# EAGLE schematic RAFT_DuckLink_Charger (EAGLE 9.5.2)
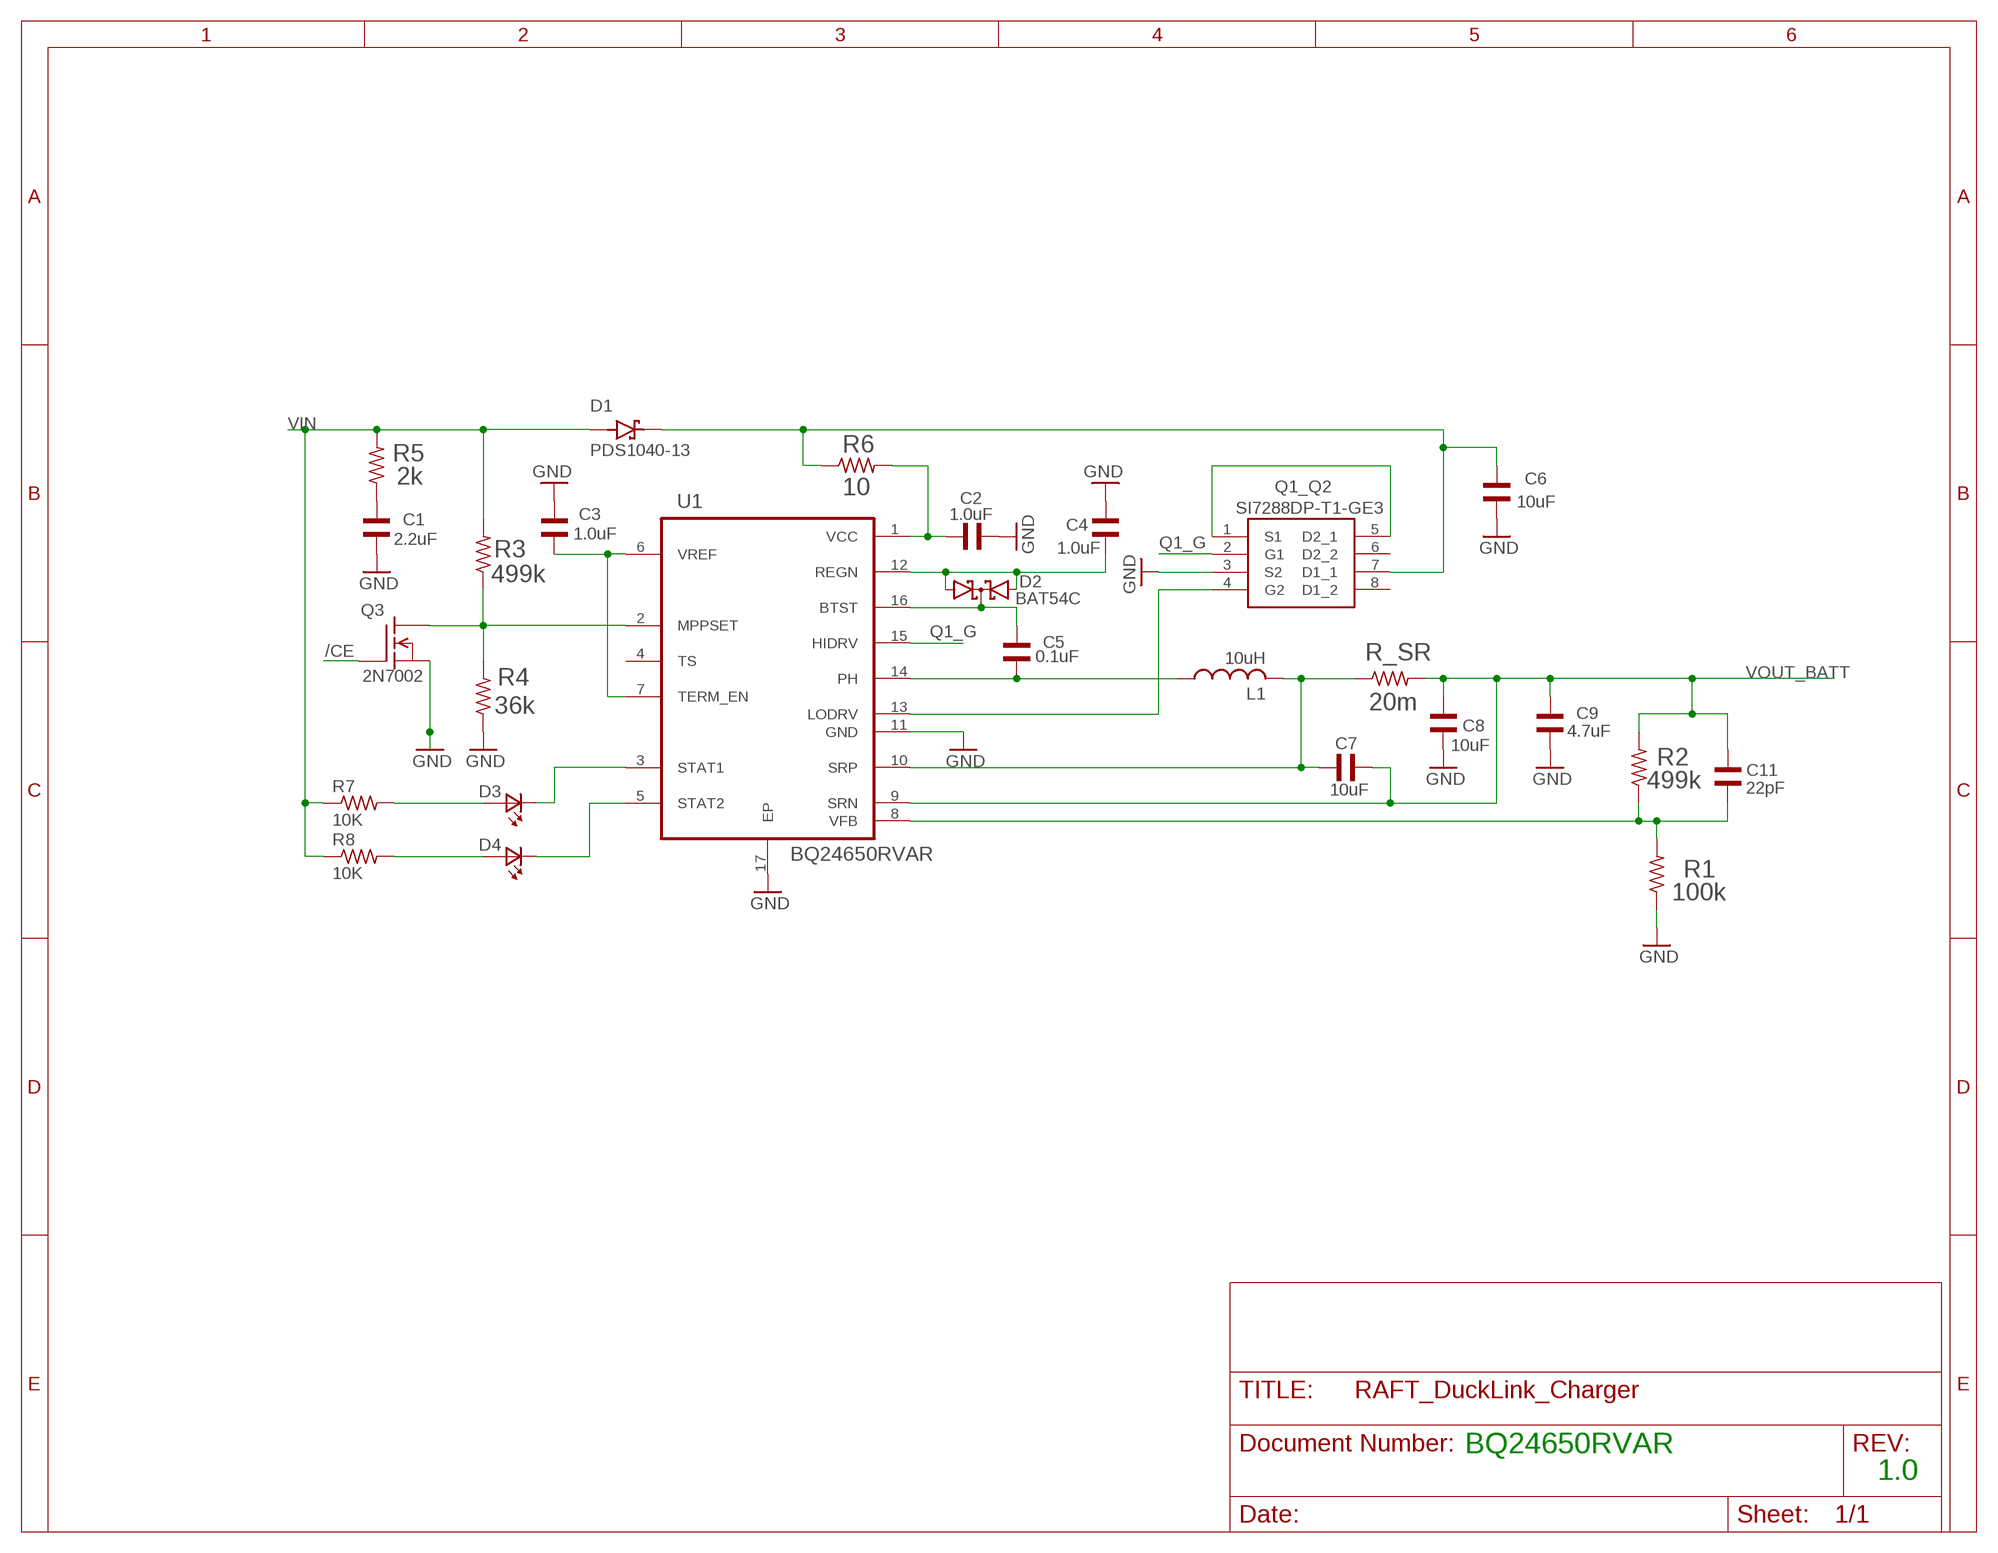
[diagram p0: schematic, sheet 1]

## Parts
C1  2.2uF  GRM155D80J225ME95D  [CAPC1005X55N]
C2  1.0uF  GCM155C71A105KE38D  [CAPC1005X70N]
C3  1.0uF  GCM155C71A105KE38D  [CAPC1005X70N]
C4  1.0uF  GCM155C71A105KE38D  [CAPC1005X70N]
C5  0.1uF  GRM155R71C104KA88D  [CAPC1005X55N]
C6  10uF  GRM155C80J106ME11D  [CAPC1005X70N]
C7  10uF  GRM155C80J106ME11D  [CAPC1005X70N]
C8  10uF  GRM155C80J106ME11D  [CAPC1005X70N]
C9  4.7uF  GRM155R60J475ME87D  [CAPC1005X55N]
C11  22pF  GCM1555C1H220JA16J  [CAPC1005X55N]
D1  PDS1040-13  [DIO_PDS1040-13]
D2  BAT54C  [SOT23]
D3  LTST-C190GKT  [0603]
D4  LTST-C190GKT  [0603]
L1  10uH  L-USL3225M  [L3225M]
Q1_Q2  SI7288DP-T1-GE3  [POWERPAK-SO8_1]
Q3  2N7002  [SOT23]
R1  100k  CRCW0402100KFKED  [RESC1005X40N]
R2  499k  CRCW0402499KFKED  [RESC1005X40N]
R3  499k  CRCW0402499KFKED  [RESC1005X40N]
R4  36k  CRCW040236K0FKED  [RESC1005X40N]
R5  2k  CRCW04022K00FKED  [RESC1005X40N]
R6  10  CRCW040210R0JNEDC  [RESC1005X35N]
R7  10K  CRCW040210K0JNED  [RESC1005X40N]
R8  10K  CRCW040210K0JNED  [RESC1005X40N]
R_SR  20m  ERJ-3BWFR020V  [RESC1608X55N]
U1  BQ24650RVAR  [QFN50P350X350X100-17N]

## Nets
/CE: Q3.1(G)
GND: C1.1 C2.2 C3.2 C4.2 C6.1 C8.1 C9.1 Q1_Q2.3(S2) R1.1 R4.1 U1.11(GND) U1.17(EP)
N$1: Q3.3(D) R3.1 R4.2 U1.2(MPPSET)
N$2: C3.1 U1.6(VREF) U1.7(TERM_EN)
N$3: C1.2 R5.1
N$4: C2.1 R6.2 U1.1(VCC)
N$5: C4.1 D2.1(A1) D2.2(A2) U1.12(REGN)
N$6: C5.1 L1.1 U1.14(PH)
N$7: C5.2 D2.3(CC) U1.16(BTST)
N$8: Q3.2(S)
N$9: C11.1 R1.2 R2.1 U1.8(VFB)
N$10: D4.2(A2) R8.2
N$11: C7.1 L1.2 R_SR.1 U1.10(SRP)
N$12: D3.2(A2) R7.2
N$13: D3.1(K2) U1.3(STAT1)
N$14: D4.1(K2) U1.5(STAT2)
N$15: Q1_Q2.1(S1) Q1_Q2.5(D2_1)
N$16: Q1_Q2.4(G2) U1.13(LODRV)
Q1_G: Q1_Q2.2(G1) U1.15(HIDRV)
SC_VIN: C6.2 D1.3(K) Q1_Q2.7(D1_1) R6.1
VIN: D1.1(A) D1.2(A) R3.2 R5.2 R7.1 R8.1
VOUT_BATT: C7.2 C8.2 C9.2 C11.2 R2.2 R_SR.2 U1.9(SRN)
Unconnected: Q1_Q2.6(D2_2) Q1_Q2.8(D1_2) U1.4(TS)

## Notes on the sheet
- BQ24650RVAR
- 1.0

## Library data of the parts
C1 = GRM155D80J225ME95D:GRM155D80J225ME95D: CAP CER 2.2UF 6.3V X6T 0402; DESCRIPTION: 2.2µF ±20% 6.3V Ceramic Capacitor X6T 0402 _1005 Metric_; DIGI-KEY_PART_NUMBER: 490-10450-1-ND; DIGI-KEY_PURCHASE_URL: https://www.digikey.com/product-detail/en/murata-electronics/GRM155D80J225ME95D/490-10450-1-ND/5026360?utm_source=snapeda&utm_medium=aggregator&utm_campaign=symbol; MF: Murata; MP: GRM155D80J225ME95D; PACKAGE: 1005 Taiyo Yuden
C2-C4 = GCM155C71A105KE38D:GCM155C71A105KE38D: Cap Ceramic 1uF 10V X7S 10% Pad SMD 0402 125C Automotive T/R; AVAILABILITY: Unavailable; DESCRIPTION: Cap Ceramic 1uF 10V X7S 10% Pad SMD 0402 125C Automotive T/R; MF: Murata; MP: GCM155C71A105KE38D; PACKAGE: 1005 Murata; PRICE: None
C5 = GRM155R71C104KA88D:GRM155R71C104KA88D: CAP CER 0.1UF 16V 10% X7R 0402; AVAILABILITY: Unavailable; DESCRIPTION: 0.1µF ±10% 16V Ceramic Capacitor X7R 0402 _1005 Metric_; MF: Murata; MP: GRM155R71C104KA88D; PACKAGE: 1005 Taiyo Yuden; PRICE: None
C6-C8 = GRM155C80J106ME11D:GRM155C80J106ME11D: 10UF 6.3V 20% 0402; AVAILABILITY: Unavailable; DESCRIPTION: 10µF ±20% 6.3V Ceramic Capacitor X6S 0402 _1005 Metric_; MF: Murata Electronics; MP: GRM155C80J106ME11D; PACKAGE: 1005 Murata; PRICE: None
C9 = GRM155R60J475ME87D:GRM155R60J475ME87D: Cap Ceramic 4.7uF 6.3V X5R 20% SMD 0402 85°C Paper T/R; AVAILABILITY: Unavailable; DESCRIPTION: 4.7µF ±20% 6.3V Ceramic Capacitor X5R 0402 _1005 Metric_; MF: Murata; MP: GRM155R60J475ME87D; PACKAGE: 1005 Taiyo Yuden; PRICE: None
C11 = GCM1555C1H220JA16J:GCM1555C1H220JA16J: Cap Ceramic 22pF 50V C0G 5% Pad SMD 0402 125C Automotive T/R; DESCRIPTION: Cap Ceramic 22pF 50V C0G 5% Pad SMD 0402 125C Automotive T/R; DIGI-KEY_PART_NUMBER: 490-17747-1-ND; DIGI-KEY_PURCHASE_URL: https://www.digikey.com/product-detail/en/murata-electronics/GCM1555C1H220JA16J/490-17747-1-ND/8539983?utm_source=snapeda&utm_medium=aggregator&utm_campaign=symbol; MF: Murata; MP: GCM1555C1H220JA16J; PACKAGE: 1005 Taiyo Yuden
D1 = PDS1040-13:PDS1040-13: PDS1040 Series 40 V 10 A Surface Mount Schottky Barrier Rectifier - PowerDI 5; AVAILABILITY: Unavailable; DESCRIPTION: Diode Schottky 40V 10A Surface Mount PowerDI™ 5; MF: Diodes Inc.; MP: PDS1040-13; PACKAGE: PowerDI™-5 Diodes Inc.; PRICE: None
D2 = diode:BAT54C: Schottky Diodes Source: Fairchild .. BAT54.pdf
D3 D4 = LTST-C190GKT:LTST-C190GKT: https://octopart.com/ltst-c190gkt-lite-on-549821; AVAILABILITY: Unavailable; DESCRIPTION: Green 569nm LED Indication - Discrete 2.1V 0603 _1608 Metric_; MF: Lite-On Inc.; MP: LTST-C190GKT; PACKAGE: 0603 Lite-On; PRICE: None
L1 = rcl:L-US: INDUCTOR, American symbol; SPICEPREFIX: L
Q1_Q2 = SI7288DP-T1-GE3:SI7288DP-T1-GE3: Trans MOSFET N-CH 40V 10An Vishay SI7288DP-T1-GE3 Dual N-channel MOSFET Transistor, 20 A, 40 V, 8-Pin PowerPAK SO Source: Datasheet <https://www.vishay.com/docs/65366/si7288dp.pdf>; ALLIED_NUMBER: 70459563; ALLIED_PRICE-STOCK: https://www.alliedelec.com/siliconix-vishay-si7288dp-t1-ge3/70459563/; DESCRIPTION: Trans MOSFET N-CH 40V 10An Vishay SI7288DP-T1-GE3 Dual N-channel MOSFET Transistor, 20 A, 40 V, 8-Pin PowerPAK SO; HEIGHT: mm; MANUFACTURER_NAME: Vishay; MANUFACTURER_PART_NUMBER: SI7288DP-T1-GE3; MOUSER_PART_NUMBER: 781-SI7288DP-T1-GE3; MOUSER_PRICE-STOCK: https://www.mouser.com/Search/Refine.aspx?Keyword=781-SI7288DP-T1-GE3; RS_PART_NUMBER: 8181390P; RS_PRICE-STOCK: http://uk.rs-online.com/web/p/products/8181390P
Q3 = 2N7002:2N7002; AVAILABILITY: Unavailable; DESCRIPTION: N-Channel 60V 200mA _Tc_ 350mW _Tc_ Surface Mount SOT-23-3; MF: STMicroelectronics; MP: 2N7002; PACKAGE: SOT-23-3 Vishay; PRICE: None
R1 = CRCW0402100KFKED:CRCW0402100KFKED
R2 R3 = CRCW0402499KFKED:CRCW0402499KFKED: RESISTOR, 0402, 499K, 1%, FULL REEL; DESCRIPTION: CRCW Series 0402 0.063 W 499 kOhm ±1 % ±100 ppm/K SMT Thick Film Chip Resistor; DIGI-KEY_PART_NUMBER: 541-499KLCT-ND; DIGI-KEY_PURCHASE_URL: https://www.digikey.com/product-detail/en/vishay-dale/CRCW0402499KFKED/541-499KLCT-ND/1183430?utm_source=snapeda&utm_medium=aggregator&utm_campaign=symbol; MF: Vishay Dale; MP: CRCW0402499KFKED; PACKAGE: 1005 Panasonic Electronic Components
R4 = CRCW040236K0FKED:CRCW040236K0FKED: Surface Mount Thick Film Resistor, AEC-Q200 CRCW Series, 36 kohm, 63 mW, - 1%, 50 V; DESCRIPTION: Surface Mount Thick Film Resistor, AEC-Q200 CRCW Series, 36 kohm, 63 mW, - 1%, 50 V; DIGI-KEY_PART_NUMBER: 541-36.0KLCT-ND; DIGI-KEY_PURCHASE_URL: https://www.digikey.com/product-detail/en/vishay-dale/CRCW040236K0FKED/541-36.0KLCT-ND/1183299?utm_source=snapeda&utm_medium=aggregator&utm_campaign=symbol; MF: Vishay; MP: CRCW040236K0FKED; PACKAGE: 1005 Panasonic Electronic Components
R5 = CRCW04022K00FKED:CRCW04022K00FKED: RESISTOR, 0402, 2K, 1%, FULL REEL; DESCRIPTION: 2 kOhms ±1% 0.063W, 1/16W Chip Resistor 0402 _1005 Metric_ Automotive AEC-Q200 Thick Film; DIGI-KEY_PART_NUMBER: 541-2.00KLCT-ND; DIGI-KEY_PURCHASE_URL: https://www.digikey.com/product-detail/en/vishay-dale/CRCW04022K00FKED/541-2.00KLCT-ND/1183155?utm_source=snapeda&utm_medium=aggregator&utm_campaign=symbol; MF: Vishay Dale; MP: CRCW04022K00FKED; PACKAGE: 1005 Panasonic Electronic Components
R6 = CRCW040210R0JNEDC:CRCW040210R0JNEDC; DESCRIPTION: D10/CRCW0402-C 200 10R 5% ET7; DIGI-KEY_PART_NUMBER: 541-4122-1-ND; DIGI-KEY_PURCHASE_URL: https://www.digikey.com/product-detail/en/vishay-dale/CRCW040210R0JNEDC/541-4122-1-ND/7928805?utm_source=snapeda&utm_medium=aggregator&utm_campaign=symbol; MF: Vishay; MP: CRCW040210R0JNEDC; PACKAGE: 1005 Yageo
R7 R8 = CRCW040210K0JNED:CRCW040210K0JNED: RES, THICK FILM, 10K, 5%, 0.063W, 0402,; DESCRIPTION: 10 kOhms ±5% 0.063W, 1/16W Chip Resistor 0402 _1005 Metric_ Automotive AEC-Q200 Thick Film; DIGI-KEY_PART_NUMBER: 541-10KJCT-ND; DIGI-KEY_PURCHASE_URL: https://www.digikey.com/product-detail/en/vishay-dale/CRCW040210K0JNED/541-10KJCT-ND/1182708?utm_source=snapeda&utm_medium=aggregator&utm_campaign=symbol; MF: Vishay Dale; MP: CRCW040210K0JNED; PACKAGE: 1005 Panasonic Electronic Components
R_SR = ERJ-3BWFR020V:ERJ-3BWFR020V; DESCRIPTION: Res Thick Film 0603 0.02 Ohm 1% 0.25W_1/4W_ ±250ppm/C Pad SMD Automotive T/R; DIGI-KEY_PART_NUMBER: P17461CT-ND; DIGI-KEY_PURCHASE_URL: https://www.digikey.com/product-detail/en/panasonic-electronic-components/ERJ-3BWFR020V/P17461CT-ND/5647945?utm_source=snapeda&utm_medium=aggregator&utm_campaign=symbol; MF: Panasonic; MP: ERJ-3BWFR020V; PACKAGE: 1608 Panasonic Electronic Components
U1 = TexasInstruments:BQ24650RVAR: Synchronous Switch-Mode Battery Charge Controller; AVAILABILITY: Unavailable; DESCRIPTION: Charger IC Multi-Chemistry 16-VQFN _3.5x3.5_; MF: Texas Instruments; MP: BQ24650RVAR; PACKAGE: VFQFN-16 Murata Power Solutions; PRICE: None